# Altium schematic sheet F407主控.SchDoc
size A3
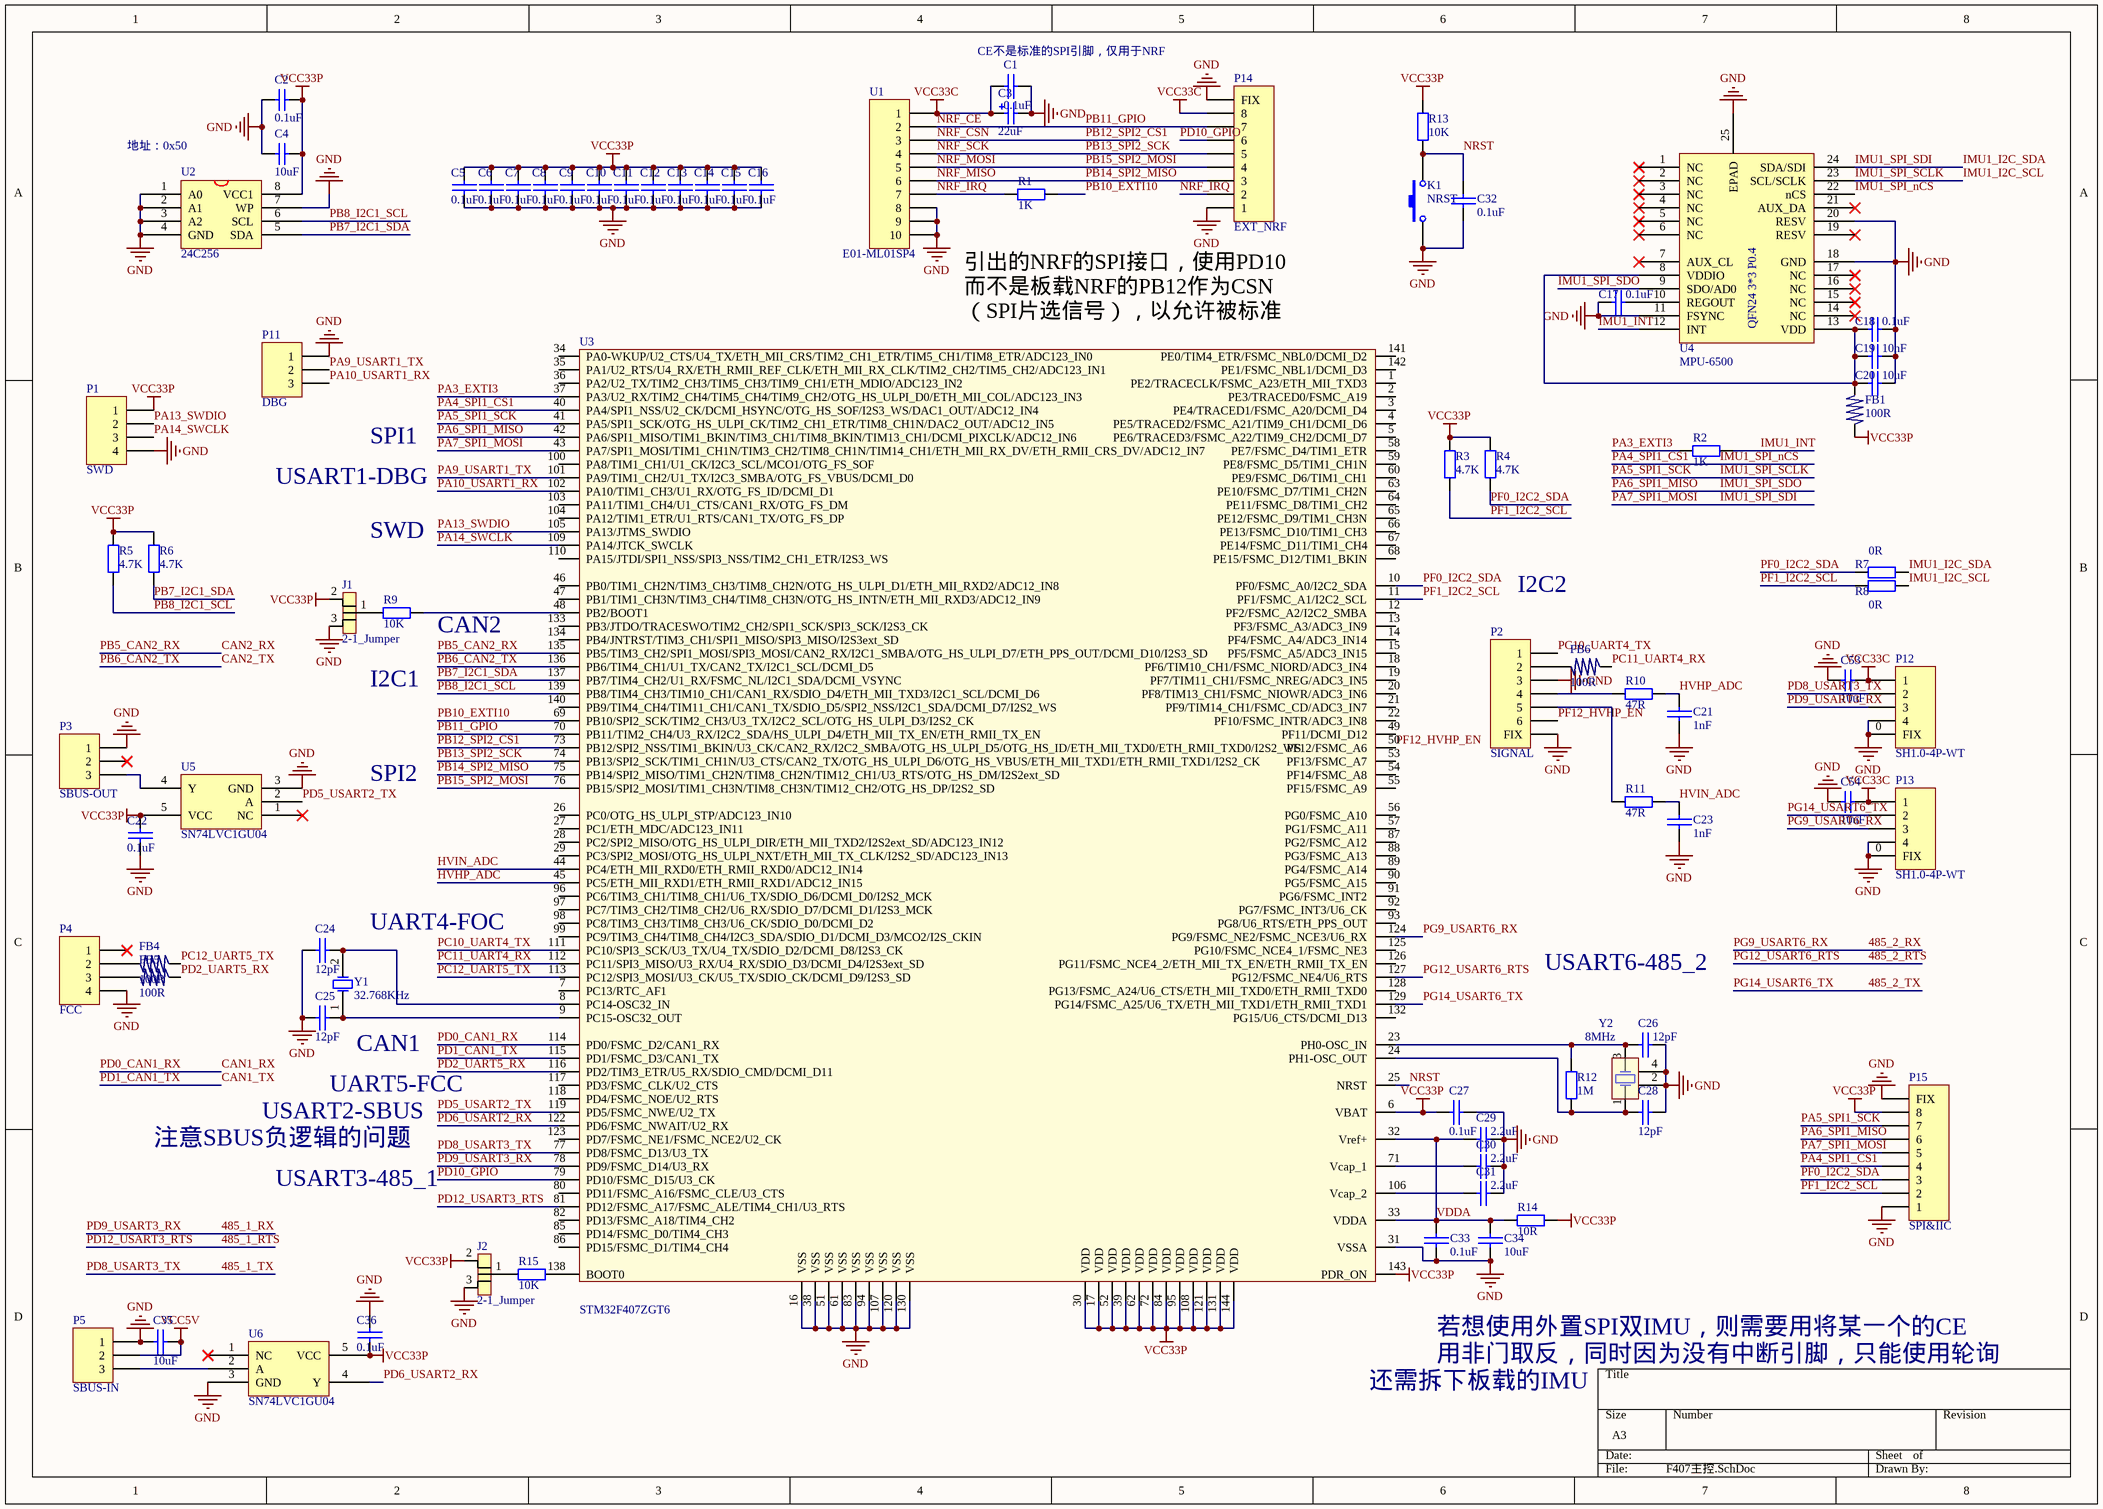
[diagram p0: F407主控.SchDoc]

## Parts
C1  0.1uF  [C0805_M]
C2  0.1uF  [C0805_M]
C3  22uF  [CS 6*6 - R]
C4  10uF  [C0805_M]
C5  0.1uF  [C0805_M]
C6  0.1uF  [C0805_M]
C7  0.1uF  [C0805_M]
C8  0.1uF  [C0805_M]
C9  0.1uF  [C0805_M]
C10  0.1uF  [C0805_M]
C11  0.1uF  [C0805_M]
C12  0.1uF  [C0805_M]
C13  0.1uF  [C0805_M]
C14  0.1uF  [C0805_M]
C15  0.1uF  [C0805_M]
C16  0.1uF  [C0805_M]
C17  0.1uF  [C0805_M]
C18  0.1uF  [C0805_M]
C19  10nF  [C0805_M]
C20  10uF  [C0805_M]
C21  1nF  [C0805_M]
C22  0.1uF  [C0805_M]
C23  1nF  [C0805_M]
C24  12pF  [C0805_M]
C25  12pF  [C0805_M]
C26  12pF  [C0805_M]
C27  0.1uF  [C0805_M]
C28  12pF  [C0805_M]
C29  2.2uF  [C0805_M]
C30  2.2uF  [C0805_M]
C31  2.2uF  [C0805_M]
C32  0.1uF  [C0805_M]
C33  0.1uF  [C0805_M]
C34  10uF  [C0805_M]
C35  10uF  [C0805_M]
C36  0.1uF  [C0805_M]
C53  10uF  [C0805_M]
C54  10uF  [C0805_M]
FB1  100R  [R0805_M]
FB4  100R  [R0805_M]
FB5  100R  [R0805_M]
FB6  100R  [R0805_M]
J1  2-1_Jumper  [2-1_Jumper]
J2  2-1_Jumper  [2-1_Jumper]
K1  NRST  [SW_SMT]
P1  SWD  [XH2.54-LI-4P]
P2  SIGNAL  [SH1.0-LT-6P]
P3  SBUS-OUT  [XH2.54-LI-3P]
P4  FCC  [XH2.54-LI-4P]
P5  SBUS-IN  [XH2.54-LI-3P]
P11  DBG  [XH2.54-LI-3P]
P12  SH1.0-4P-WT  [SH1.0-WT-4P]
P13  SH1.0-4P-WT  [SH1.0-WT-4P]
P14  EXT_NRF  [SH1.0-WT-8P]
P15  SPI&IIC  [SH1.0-WT-8P]
R1  1K  [R0805_M]
R2  1K  [R0805_M]
R3  4.7K  [R0805_M]
R4  4.7K  [R0805_M]
R5  4.7K  [R0805_M]
R6  4.7K  [R0805_M]
R7  0R  [R0805_M]
R8  0R  [R0805_M]
R9  10K  [R0805_M]
R10  47R  [R0805_M]
R11  47R  [R0805_M]
R12  1M  [R0805_M]
R13  10K  [R0805_M]
R14  10R  [R0805_M]
R15  10K  [R0805_M]
U1  E01-ML01SP4  [PE01-ML01SP4]
U2  24C256  [SOP-8]
U3  STM32F407ZGT6  [LQFP144]
U4  MPU-6500  [QFN24-L3.0-W3.0-P0.4]
U5  SN74LVC1GU04  [SOT-23-5]
U6  SN74LVC1GU04  [SOT-23-5]
Y1  32.768KHz  [OSC-3215-2P]
Y2  8MHz  [OSC-3225-4P]

## Nets
GND: C1.1 C2.1 C3.2 C4.1 C5.1 C6.1 C7.1 C8.1 C9.1 C10.1 C11.1 C12.1 C13.1 C14.1 C15.1 C16.1 C17.2 C18.1 C19.1 C20.1 C21.1 C22.1 C23.1 C24.1 C25.1 C26.2 C27.1 C28.2 C29.2 C30.2 C31.2 C32.1 C33.1 C34.1 C35.2 C36.2 C53.1 C54.1 J1.3 J2.3 K1.1 P1.4 P2.0(FIX) P2.3 P3.1 P4.4 P5.1 P11.1 P12.0(FIX) P12.4 P13.0(FIX) P13.4 P14.0(FIX) P14.1 P15.0(FIX) P15.1 U1.8 U1.9 U1.10 U2.1(A0) U2.2(A1) U2.3(A2) U2.4(GND) U2.7(WP) U3.16(VSS) U3.31(VSSA) U3.38(VSS) U3.51(VSS) U3.61(VSS) U3.83(VSS) U3.94(VSS) U3.107(VSS) U3.120(VSS) U3.130(VSS) U4.11(FSYNC) U4.18(GND) U4.20(RESV) U4.25(EPAD) U5.3(GND) U6.3(GND) Y2.2(GND) Y2.4(GND)
VCC5V: C35.1 P5.2
VCC33C: C1.2 C3.1 C53.2 C54.2 P12.1 P13.1 P14.8 U1.1
VCC33P: C2.2 C4.2 C5.2 C6.2 C7.2 C8.2 C9.2 C10.2 C11.2 C12.2 C13.2 C14.2 C15.2 C16.2 C22.2 C27.2 C36.1 FB1.2 J1.2 J2.2 P1.1 P15.8 R3.1 R4.1 R5.1 R6.1 R13.1 R14.1 U2.8(VCC1) U3.6(VBAT) U3.17(VDD) U3.30(VDD) U3.39(VDD) U3.52(VDD) U3.62(VDD) U3.72(VDD) U3.84(VDD) U3.95(VDD) U3.108(VDD) U3.121(VDD) U3.131(VDD) U3.143(PDR_ON) U3.144(VDD) U5.5(VCC) U6.5(VCC)
485_1_RTS: U3.81(PD12/FSMC_A17/FSMC_ALE/TIM4_CH1/U3_RTS)  [also labelled PD12_USART3_RTS]
485_1_RX: P12.3 U3.78(PD9/FSMC_D14/U3_RX)  [also labelled PD9_USART3_RX]
485_1_TX: P12.2 U3.77(PD8/FSMC_D13/U3_TX)  [also labelled PD8_USART3_TX]
485_2_RTS: U3.127(PG12/FSMC_NE4/U6_RTS)  [also labelled PG12_USART6_RTS]
485_2_RX: P13.3 U3.124(PG9/FSMC_NE2/FSMC_NCE3/U6_RX)  [also labelled PG9_USART6_RX]
485_2_TX: P13.2 U3.129(PG14/FSMC_A25/U6_TX/ETH_MII_TXD1/ETH_RMII_TXD1)  [also labelled PG14_USART6_TX]
CAN1_RX: U3.114(PD0/FSMC_D2/CAN1_RX)  [also labelled PD0_CAN1_RX]
CAN1_TX: U3.115(PD1/FSMC_D3/CAN1_TX)  [also labelled PD1_CAN1_TX]
CAN2_RX: U3.135(PB5/TIM3_CH2/SPI1_MOSI/SPI3_MOSI/CAN2_RX/I2C1_SMBA/OTG_HS_ULPI_D7/ETH_PPS_OUT/DCMI_D10/I2S3_SD)  [also labelled PB5_CAN2_RX]
CAN2_TX: U3.136(PB6/TIM4_CH1/U1_TX/CAN2_TX/I2C1_SCL/DCMI_D5)  [also labelled PB6_CAN2_TX]
HVHP_ADC: C21.2 R10.2 U3.45(PC5/ETH_MII_RXD1/ETH_RMII_RXD1/ADC12_IN15)
HVIN_ADC: C23.2 R11.2 U3.44(PC4/ETH_MII_RXD0/ETH_RMII_RXD0/ADC12_IN14)
IMU1_I2C_SCL: P15.7 R8.1 U3.41(PA5/SPI1_SCK/OTG_HS_ULPI_CK/TIM2_CH1_ETR/TIM8_CH1N/DAC2_OUT/ADC12_IN5) U4.23(SCL/SCLK)  [also labelled IMU1_SPI_SCLK, PA5_SPI1_SCK]
IMU1_I2C_SDA: P15.5 R7.1 U3.43(PA7/SPI1_MOSI/TIM1_CH1N/TIM3_CH2/TIM8_CH1N/TIM14_CH1/ETH_MII_RX_DV/ETH_RMII_CRS_DV/ADC12_IN7) U4.24(SDA/SDI)  [also labelled IMU1_SPI_SDI, PA7_SPI1_MOSI]
IMU1_INT: R2.1 U4.12(INT)
IMU1_SPI_nCS: P15.4 U3.40(PA4/SPI1_NSS/U2_CK/DCMI_HSYNC/OTG_HS_SOF/I2S3_WS/DAC1_OUT/ADC12_IN4) U4.22(nCS)  [also labelled PA4_SPI1_CS1]
IMU1_SPI_SDO: P15.6 U3.42(PA6/SPI1_MISO/TIM1_BKIN/TIM3_CH1/TIM8_BKIN/TIM13_CH1/DCMI_PIXCLK/ADC12_IN6) U4.9(SDO/AD0)  [also labelled PA6_SPI1_MISO]
NRF_CE: P14.7 U1.2 U3.70(PB11/TIM2_CH4/U3_RX/I2C2_SDA/HS_ULPI_D4/ETH_MII_TX_EN/ETH_RMII_TX_EN)  [also labelled PB11_GPIO]
NRF_CSN: U1.3 U3.73(PB12/SPI2_NSS/TIM1_BKIN/U3_CK/CAN2_RX/I2C2_SMBA/OTG_HS_ULPI_D5/OTG_HS_ID/ETH_MII_TXD0/ETH_RMII_TXD0/I2S2_WS)  [also labelled PB12_SPI2_CS1]
NRF_IRQ: P14.2 R1.2 U1.7
NRF_MISO: P14.3 U1.6 U3.75(PB14/SPI2_MISO/TIM1_CH2N/TIM8_CH2N/TIM12_CH1/U3_RTS/OTG_HS_DM/I2S2ext_SD)  [also labelled PB14_SPI2_MISO]
NRF_MOSI: P14.4 U1.5 U3.76(PB15/SPI2_MOSI/TIM1_CH3N/TIM8_CH3N/TIM12_CH2/OTG_HS_DP/I2S2_SD)  [also labelled PB15_SPI2_MOSI]
NRF_SCK: P14.5 U1.4 U3.74(PB13/SPI2_SCK/TIM1_CH1N/U3_CTS/CAN2_TX/OTG_HS_ULPI_D6/OTG_HS_VBUS/ETH_MII_TXD1/ETH_RMII_TXD1/I2S2_CK)  [also labelled PB13_SPI2_SCK]
NRST: C32.2 K1.2 R13.2 U3.25(NRST)
PA3_EXTI3: R2.2 U3.37(PA3/U2_RX/TIM2_CH4/TIM5_CH4/TIM9_CH2/OTG_HS_ULPI_D0/ETH_MII_COL/ADC123_IN3)
PA9_USART1_TX: P11.2 U3.101(PA9/TIM1_CH2/U1_TX/I2C3_SMBA/OTG_FS_VBUS/DCMI_D0)
PA10_USART1_RX: P11.3 U3.102(PA10/TIM1_CH3/U1_RX/OTG_FS_ID/DCMI_D1)
PA13_SWDIO: P1.2 U3.105(PA13/JTMS_SWDIO)
PA14_SWCLK: P1.3 U3.109(PA14/JTCK_SWCLK)
PB7_I2C1_SDA: R6.2 U2.5(SDA) U3.137(PB7/TIM4_CH2/U1_RX/FSMC_NL/I2C1_SDA/DCMI_VSYNC)
PB8_I2C1_SCL: R5.2 U2.6(SCL) U3.139(PB8/TIM4_CH3/TIM10_CH1/CAN1_RX/SDIO_D4/ETH_MII_TXD3/I2C1_SCL/DCMI_D6)
PB10_EXTI10: R1.1 U3.69(PB10/SPI2_SCK/TIM2_CH3/U3_TX/I2C2_SCL/OTG_HS_ULPI_D3/I2S2_CK)
PC10_UART4_TX: P2.1 U3.111(PC10/SPI3_SCK/U3_TX/U4_TX/SDIO_D2/DCMI_D8/I2S3_CK)
PC11_UART4_RX: FB6.1 U3.112(PC11/SPI3_MISO/U3_RX/U4_RX/SDIO_D3/DCMI_D4/I2S3ext_SD)
PC12_UART5_TX: FB4.1 U3.113(PC12/SPI3_MOSI/U3_CK/U5_TX/SDIO_CK/DCMI_D9/I2S3_SD)
PD2_UART5_RX: FB5.1 U3.116(PD2/TIM3_ETR/U5_RX/SDIO_CMD/DCMI_D11)
PD5_USART2_TX: U3.119(PD5/FSMC_NWE/U2_TX) U5.2(A)
PD6_USART2_RX: U3.122(PD6/FSMC_NWAIT/U2_RX) U6.4(Y)
PD10_GPIO: P14.6 U3.79(PD10/FSMC_D15/U3_CK)
PF0_I2C2_SDA: P15.3 R4.2 R7.2 U3.10(PF0/FSMC_A0/I2C2_SDA)
PF1_I2C2_SCL: P15.2 R3.2 R8.2 U3.11(PF1/FSMC_A1/I2C2_SCL)
PF12_HVHP_EN: P2.6 U3.50(PF12/FSMC_A6)
VDDA: C29.1 C33.2 C34.2 R14.2 U3.32(Vref+) U3.33(VDDA)
NetC17_1: C17.1 U4.10(REGOUT)
NetC18_2: C18.2 C19.2 C20.2 FB1.1 U4.8(VDDIO) U4.13(VDD)
NetC24_2: C24.2 U3.8(PC14-OSC32_IN) Y1.2(OSC2)
NetC25_2: C25.2 U3.9(PC15-OSC32_OUT) Y1.1(OSC1)
NetC26_1: C26.1 R12.2 U3.23(PH0-OSC_IN) Y2.3(OSC2)
NetC28_1: C28.1 R12.1 U3.24(PH1-OSC_OUT) Y2.1(OSC1)
NetC30_1: C30.1 U3.71(Vcap_1)
NetC31_1: C31.1 U3.106(Vcap_2)
NetFB4_2: FB4.2 P4.2
NetFB5_2: FB5.2 P4.3
NetFB6_2: FB6.2 P2.2
NetJ1_1: J1.1 R9.2
NetJ2_1: J2.1 R15.2
NetP2_4: P2.4 R10.1
NetP2_5: P2.5 R11.1
NetP3_3: P3.3 U5.4(Y)
NetP5_3: P5.3 U6.2(A)
NetR9_1: R9.1 U3.48(PB2/BOOT1)
NetR15_1: R15.1 U3.138(BOOT0)

Not connected (* = marked no-connect by the designer): P3 2*; P4 1*; U3 1(PE2/TRACECLK/FSMC_A23/ETH_MII_TXD3) 2(PE3/TRACED0/FSMC_A19) 3(PE4/TRACED1/FSMC_A20/DCMI_D4) 4(PE5/TRACED2/FSMC_A21/TIM9_CH1/DCMI_D6) 5(PE6/TRACED3/FSMC_A22/TIM9_CH2/DCMI_D7) 7(PC13/RTC_AF1) 12(PF2/FSMC_A2/I2C2_SMBA) 13(PF3/FSMC_A3/ADC3_IN9) 14(PF4/FSMC_A4/ADC3_IN14) 15(PF5/FSMC_A5/ADC3_IN15) 18(PF6/TIM10_CH1/FSMC_NIORD/ADC3_IN4) 19(PF7/TIM11_CH1/FSMC_NREG/ADC3_IN5) 20(PF8/TIM13_CH1/FSMC_NIOWR/ADC3_IN6) 21(PF9/TIM14_CH1/FSMC_CD/ADC3_IN7) 22(PF10/FSMC_INTR/ADC3_IN8) 26(PC0/OTG_HS_ULPI_STP/ADC123_IN10) 27(PC1/ETH_MDC/ADC123_IN11) 28(PC2/SPI2_MISO/OTG_HS_ULPI_DIR/ETH_MII_TXD2/I2S2ext_SD/ADC123_IN12) 29(PC3/SPI2_MOSI/OTG_HS_ULPI_NXT/ETH_MII_TX_CLK/I2S2_SD/ADC123_IN13) 34(PA0-WKUP/U2_CTS/U4_TX/ETH_MII_CRS/TIM2_CH1_ETR/TIM5_CH1/TIM8_ETR/ADC123_IN0) 35(PA1/U2_RTS/U4_RX/ETH_RMII_REF_CLK/ETH_MII_RX_CLK/TIM2_CH2/TIM5_CH2/ADC123_IN1) 36(PA2/U2_TX/TIM2_CH3/TIM5_CH3/TIM9_CH1/ETH_MDIO/ADC123_IN2) 46(PB0/TIM1_CH2N/TIM3_CH3/TIM8_CH2N/OTG_HS_ULPI_D1/ETH_MII_RXD2/ADC12_IN8) 47(PB1/TIM1_CH3N/TIM3_CH4/TIM8_CH3N/OTG_HS_INTN/ETH_MII_RXD3/ADC12_IN9) 49(PF11/DCMI_D12) 53(PF13/FSMC_A7) 54(PF14/FSMC_A8) 55(PF15/FSMC_A9) 56(PG0/FSMC_A10) 57(PG1/FSMC_A11) 58(PE7/FSMC_D4/TIM1_ETR) 59(PE8/FSMC_D5/TIM1_CH1N) 60(PE9/FSMC_D6/TIM1_CH1) 63(PE10/FSMC_D7/TIM1_CH2N) 64(PE11/FSMC_D8/TIM1_CH2) 65(PE12/FSMC_D9/TIM1_CH3N) 66(PE13/FSMC_D10/TIM1_CH3) 67(PE14/FSMC_D11/TIM1_CH4) 68(PE15/FSMC_D12/TIM1_BKIN) 80(PD11/FSMC_A16/FSMC_CLE/U3_CTS) 82(PD13/FSMC_A18/TIM4_CH2) 85(PD14/FSMC_D0/TIM4_CH3) 86(PD15/FSMC_D1/TIM4_CH4) 87(PG2/FSMC_A12) 88(PG3/FSMC_A13) 89(PG4/FSMC_A14) 90(PG5/FSMC_A15) 91(PG6/FSMC_INT2) 92(PG7/FSMC_INT3/U6_CK) 93(PG8/U6_RTS/ETH_PPS_OUT) 96(PC6/TIM3_CH1/TIM8_CH1/U6_TX/SDIO_D6/DCMI_D0/I2S2_MCK) 97(PC7/TIM3_CH2/TIM8_CH2/U6_RX/SDIO_D7/DCMI_D1/I2S3_MCK) 98(PC8/TIM3_CH3/TIM8_CH3/U6_CK/SDIO_D0/DCMI_D2) 99(PC9/TIM3_CH4/TIM8_CH4/I2C3_SDA/SDIO_D1/DCMI_D3/MCO2/I2S_CKIN) 100(PA8/TIM1_CH1/U1_CK/I2C3_SCL/MCO1/OTG_FS_SOF) 103(PA11/TIM1_CH4/U1_CTS/CAN1_RX/OTG_FS_DM) 104(PA12/TIM1_ETR/U1_RTS/CAN1_TX/OTG_FS_DP) 110(PA15/JTDI/SPI1_NSS/SPI3_NSS/TIM2_CH1_ETR/I2S3_WS) 117(PD3/FSMC_CLK/U2_CTS) 118(PD4/FSMC_NOE/U2_RTS) 123(PD7/FSMC_NE1/FSMC_NCE2/U2_CK) 125(PG10/FSMC_NCE4_1/FSMC_NE3) 126(PG11/FSMC_NCE4_2/ETH_MII_TX_EN/ETH_RMII_TX_EN) 128(PG13/FSMC_A24/U6_CTS/ETH_MII_TXD0/ETH_RMII_TXD0) 132(PG15/U6_CTS/DCMI_D13) 133(PB3/JTDO/TRACESWO/TIM2_CH2/SPI1_SCK/SPI3_SCK/I2S3_CK) 134(PB4/JNTRST/TIM3_CH1/SPI1_MISO/SPI3_MISO/I2S3ext_SD) 140(PB9/TIM4_CH4/TIM11_CH1/CAN1_TX/SDIO_D5/SPI2_NSS/I2C1_SDA/DCMI_D7/I2S2_WS) 141(PE0/TIM4_ETR/FSMC_NBL0/DCMI_D2) 142(PE1/FSMC_NBL1/DCMI_D3); U4 1(NC)* 2(NC)* 3(NC)* 4(NC)* 5(NC)* 6(NC)* 7(AUX_CL)* 14(NC)* 15(NC)* 16(NC)* 17(NC)* 19(RESV)* 21(AUX_DA)*; U5 1(NC)*; U6 1(NC)*

## Notes on the sheet
- (near C1) CE不是标准的SPI引脚，仅用于NRF
- (near U2) 地址：0x50
- (near U3) 引出的NRF的SPI接口，使用PD10而不是板载NRF的PB12作为CSN（SPI片选信号），以允许被标准SPI设备复用
- SPI1
- USART1-DBG
- SWD
- (near R9) CAN2
- I2C2
- I2C1
- SPI2
- UART4-FOC
- USART6-485_2
- CAN1
- USART2-SBUS
- UART5-FCC
- 注意SBUS负逻辑的问题
- USART3-485_1
- 还需拆下板载的IMU
- 若想使用外置SPI双IMU，则需要用将某一个的CE
- 用非门取反，同时因为没有中断引脚，只能使用轮询
- (in symbol MPU-6500) QFN24 3*3 P0.4

## Library data of the parts
C1 C5-C36 = CAP: Capacitor
C2 C4 C53 C54 = Cap: Capacitor; Value: 100pF; Published: 8-Jun-2000; LatestRevisionDate: 17-Jul-2002; LatestRevisionNote: Re-released for DXP Platform.; PackageReference: RAD-0.3; Publisher: Altium Limited; PackageDescription: Radial Cap, Thru-Hole; 2 Leads; 0.3 in Pin Spacing
C3 = Cap Pol2: Polarized Capacitor (Axial); Value: 100pF; Published: 8-Jun-2000; LatestRevisionDate: 17-Jul-2002; LatestRevisionNote: Re-released for DXP Platform.; PackageReference: POLAR0.8; Publisher: Altium Limited; PackageDescription: Polarized Capacitor; 2 Leads
FB1 FB4-FB6 = L
K1 = SW-PB: Switch; Published: 24-Mar-1999; LatestRevisionDate: 17-Jul-2002; LatestRevisionNote: Re-released for DXP Platform.; PackageReference: SPST-2; Publisher: Altium Limited; PackageDescription: Switch; 2 Leads
P1 P4 = Header 4: Header, 4-Pin; LatestRevisionDate: 17-Jul-2002; LatestRevisionNote: Re-released for DXP Platform.; Publisher: Altium Limited
P2 = Header 7: Header, 7-Pin; LatestRevisionDate: 17-Jul-2002; LatestRevisionNote: Re-released for DXP Platform.; Publisher: Altium Limited
P3 P5 P11 = Header 3: Header, 3-Pin; LatestRevisionDate: 17-Jul-2002; LatestRevisionNote: Re-released for DXP Platform.; Publisher: Altium Limited
P12 P13 = Header 5: Header, 5-Pin; LatestRevisionDate: 17-Jul-2002; LatestRevisionNote: Re-released for DXP Platform.; Publisher: Altium Limited
P14 P15 = Header 9: Header, 9-Pin; LatestRevisionDate: 17-Jul-2002; LatestRevisionNote: Re-released for DXP Platform.; Publisher: Altium Limited
R1 R2 = Res2: Resistor; Published: 8-Jun-2000; LatestRevisionDate: 17-Jul-2002; LatestRevisionNote: Re-released for DXP Platform.; PackageReference: AXIAL-0.4; Publisher: Altium Limited; PackageDescription: Axial Device, Thru-Hole; 2 Leads; 0.4 in Pin Spacing; Value: 1K
R3-R15 = Res2: Resistor; Value: 1K; Published: 8-Jun-2000; LatestRevisionDate: 17-Jul-2002; LatestRevisionNote: Re-released for DXP Platform.; PackageReference: AXIAL-0.4; Publisher: Altium Limited; PackageDescription: Axial Device, Thru-Hole; 2 Leads; 0.4 in Pin Spacing
U1 = Header 10: Header, 10-Pin; LatestRevisionDate: 17-Jul-2002; LatestRevisionNote: Re-released for DXP Platform.; Publisher: Altium Limited
U3 = STM32F407ZET6
U4 = MPU-6500: 6 DoF IMU Footprint QFN24 3*3 P0.4
Y1 = XTAL: CL=12.5pF; Published: 8-Jun-2000; LatestRevisionDate: 17-Jul-2002; LatestRevisionNote: Re-released for DXP Platform.; PackageReference: R38; Publisher: Altium Limited; PackageDescription: Crystal, Thru-Hole; 2 Leads; Body 3.1 x 8.2 mm (Dia.xH)
Y2 = XTAL-4: CL=12pF; Published: 8-Jun-2000; LatestRevisionDate: 17-Jul-2002; LatestRevisionNote: Re-released for DXP Platform.; PackageReference: R38; Publisher: Altium Limited; PackageDescription: Crystal, Thru-Hole; 2 Leads; Body 3.1 x 8.2 mm (Dia.xH)